# Altium project inverter.PrjPcb
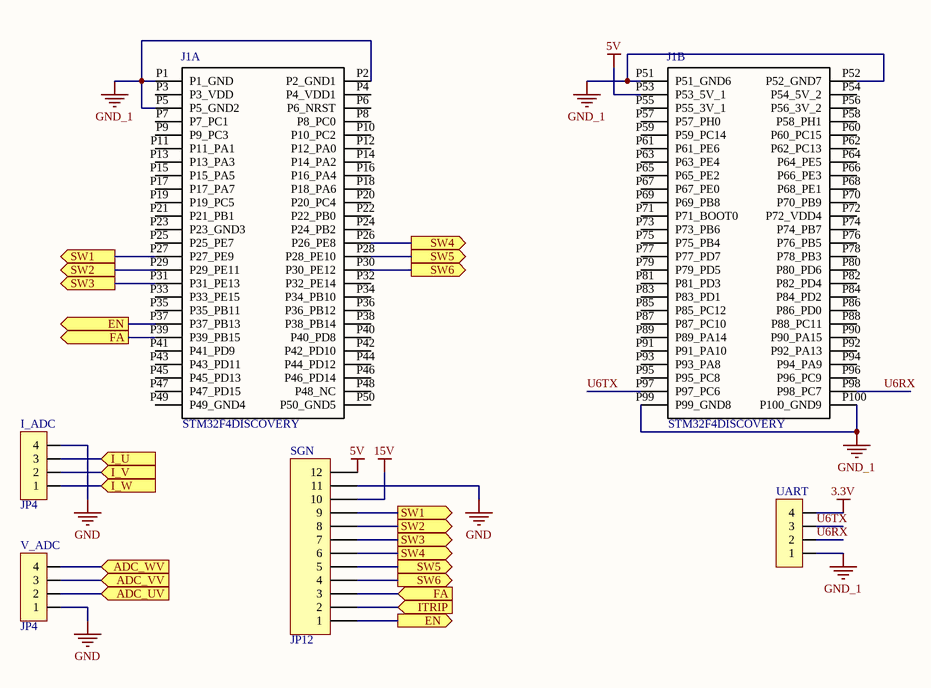
[diagram p0: KIT_STM32F4.SchDoc]
4 sheets, 124 parts. Net scope: flat (ports and power ports of the same name join across sheets).
Board file: PCB1.PcbDoc
Sheets:
  KIT_STM32F4.SchDoc
  Source.SchDoc
  Sheet1.SchDoc
  Sheet2.SchDoc

## Sheet KIT_STM32F4.SchDoc
size A

### Parts
I_ADC  JP4  [JP4-C1T]
J1  STM32F4DISCOVERY  [STMICROELECTRONICS_STM32F4DISCOVERY_STM32F4DISCOVERY(Primary)]  (parts A,B of 2)
SGN  JP12  [JP12-D1T]
UART  JP4  [JP4-C1T]  (value not drawn)
V_ADC  JP4  [JP4-C1T]

### Ports
ADC_UV (in), ADC_VV (in), ADC_WV (in), EN (out), FA (in), FA (out), I_U (in), I_V (in), I_W (in), ITRIP (in), SW1 (out), SW2 (out), SW3 (out), SW4 (out), SW5 (out), SW6 (out)

### Nets
3.3V: UART.4
5V: J1.P53(P53_5V_1) SGN.12
15V: SGN.10
GND: I_ADC.4 SGN.11 V_ADC.1
GND_1: J1.P1(P1_GND) J1.P2(P2_GND1) J1.P5(P5_GND2) J1.P51(P51_GND6) J1.P52(P52_GND7) J1.P99(P99_GND8) J1.P100(P100_GND9) UART.1
U6RX: J1.P98(P98_PC7) UART.2
U6TX: J1.P97(P97_PC6) UART.3
NetI_ADC_1: I_ADC.1 ; port I_W
NetI_ADC_2: I_ADC.2 ; port I_V
NetI_ADC_3: I_ADC.3 ; port I_U
NetIC1_2: J1.P27(P27_PE9) SGN.9 ; port SW1
NetIC1_3: J1.P29(P29_PE11) SGN.8 ; port SW2
NetIC1_4: J1.P31(P31_PE13) SGN.7 ; port SW3
NetIC1_5: J1.P26(P26_PE8) SGN.6 ; port SW4
NetIC1_6: J1.P28(P28_PE10) SGN.5 ; port SW5
NetIC1_7: J1.P30(P30_PE12) SGN.4 ; port SW6
NetIC1_8: J1.P39(P39_PB15) SGN.3 ; port FA
NetIC1_9: SGN.2 ; port ITRIP
NetIC1_10: J1.P37(P37_PB13) SGN.1 ; port EN
NetIC2_1: V_ADC.2 ; port ADC_UV
NetIC2_7: V_ADC.3 ; port ADC_VV
NetIC4_1: V_ADC.4 ; port ADC_WV

Not connected (* = marked no-connect by the designer): J1 P3(P3_VDD) P4(P4_VDD1) P6(P6_NRST) P7(P7_PC1) P8(P8_PC0) P9(P9_PC3) P10(P10_PC2) P11(P11_PA1) P12(P12_PA0) P13(P13_PA3) P14(P14_PA2) P15(P15_PA5) P16(P16_PA4) P17(P17_PA7) P18(P18_PA6) P19(P19_PC5) P20(P20_PC4) P21(P21_PB1) P22(P22_PB0) P23(P23_GND3) P24(P24_PB2) P25(P25_PE7) P32(P32_PE14) P33(P33_PE15) P34(P34_PB10) P35(P35_PB11) P36(P36_PB12) P38(P38_PB14) P40(P40_PD8) P41(P41_PD9) P42(P42_PD10) P43(P43_PD11) P44(P44_PD12) P45(P45_PD13) P46(P46_PD14) P47(P47_PD15) P48(P48_NC) P49(P49_GND4) P50(P50_GND5) P54(P54_5V_2) P55(P55_3V_1) P56(P56_3V_2) P57(P57_PH0) P58(P58_PH1) P59(P59_PC14) P60(P60_PC15) P61(P61_PE6) P62(P62_PC13) P63(P63_PE4) P64(P64_PE5) P65(P65_PE2) P66(P66_PE3) P67(P67_PE0) P68(P68_PE1) P69(P69_PB8) P70(P70_PB9) P71(P71_BOOT0) P72(P72_VDD4) P73(P73_PB6) P74(P74_PB7) P75(P75_PB4) P76(P76_PB5) P77(P77_PD7) P78(P78_PB3) P79(P79_PD5) P80(P80_PD6) P81(P81_PD3) P82(P82_PD4) P83(P83_PD1) P84(P84_PD2) P85(P85_PC12) P86(P86_PD0) P87(P87_PC10) P88(P88_PC11) P89(P89_PA14) P90(P90_PA15) P91(P91_PA10) P92(P92_PA13) P93(P93_PA8) P94(P94_PA9) P95(P95_PC8) P96(P96_PC9)

### Library data of the parts
I_ADC UART V_ADC = JP4: WR-PHD 2.54 mm Angled Socket Header; Manufacturer: W¨¹rth Elektronik eiSos GmbH; partNo: 613004143121; ComponentLink1 Description: Manufacturer; ComponentLink2 Description: Datasheet; NoPins: 04; Created Date: 29 March 2013; ComponentLink1URL: http://www.we-online.com; ComponentLink2URL: http://katalog.we-online.de/em/datasheet/6130xx143121.pdf; Created by: Karrer Zheng
J1 = STM32F4DISCOVERY: Development kit: ARM ST; pin strips, pin header; No.of; MF: STMicroelectronics; Package: None; MP: STM32F4DISCOVERY; Price: None; Availability: Unavailable; SnapEDA_Link: https://www.snapeda.com/parts/STM32F4DISCOVERY/STMicroelectronics/view-part/?ref=snap; Value: *
SGN = JP12: WR-PHD 2.54 mm Angled Socket Header; Manufacturer: W¨¹rth Elektronik eiSos GmbH; partNo: 613012143121; ComponentLink1 Description: Manufacturer; ComponentLink2 Description: Datasheet; NoPins: 12; Created Date: 29 March 2013; ComponentLink1URL: http://www.we-online.com; ComponentLink2URL: http://katalog.we-online.de/em/datasheet/6130xx143121.pdf; Created by: Karrer Zheng

## Sheet Source.SchDoc
size A3
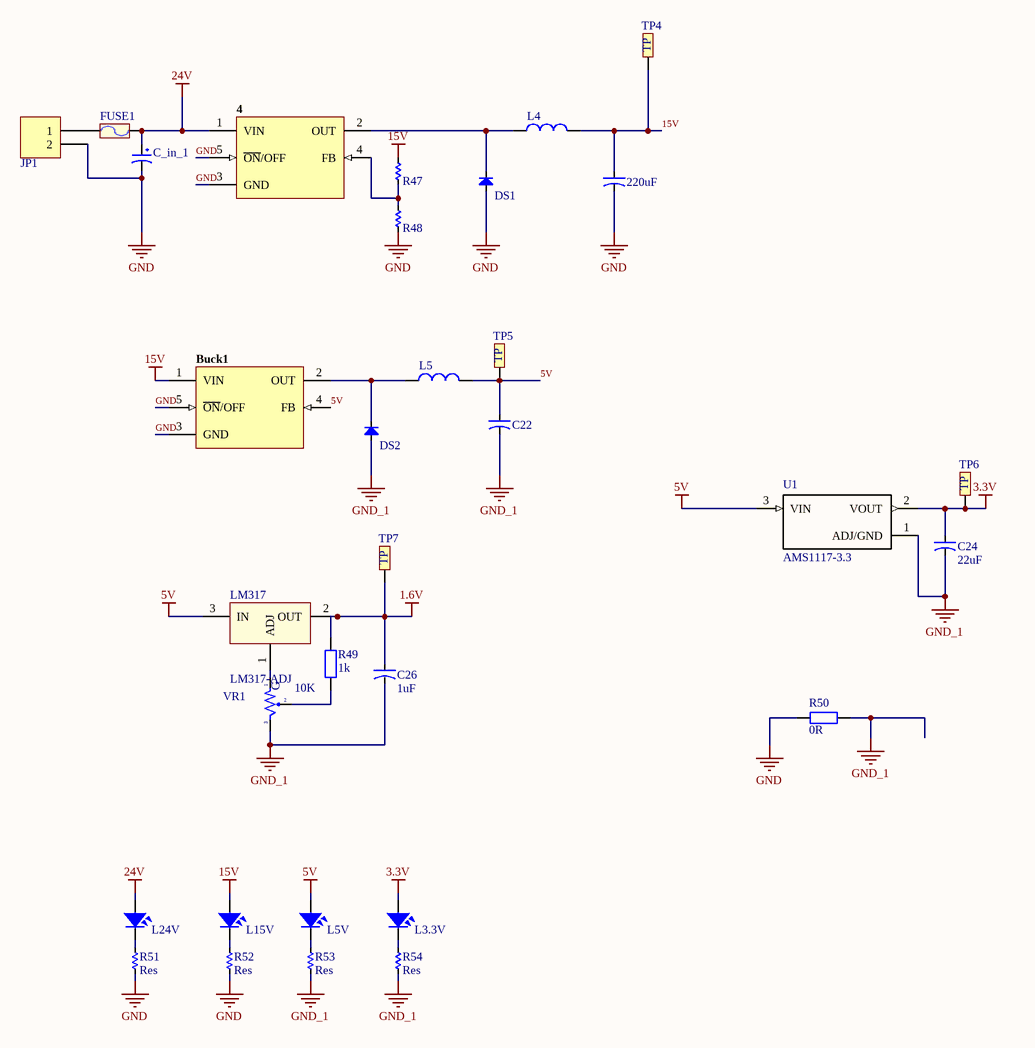
[diagram p1: Source.SchDoc]

### Parts
4  LM2576-ADJ  [TO263]  (value not drawn)
220uF  CN-ALU-DIP  [CA-ALU-5R]  (value not drawn)
Buck1  LM2576-5V  [TO263]  (value not drawn)
C22  >400uF  [CA-ALU-5R]  (value not drawn)
C24  22uF  [CA-ALU-2.54]
C26  1uF  [CA-ALU-2.54]
C_in_1  100->220uF  [CP1.5/3.4]  (value not drawn)
DS1  Diode  [DIO-1A]  (value not drawn)
DS2  Diode  [DIO-1A]  (value not drawn)
FUSE1  F1A  [Fuse1]  (value not drawn)
JP1  Header 2_1  [HED2]  (value not drawn)
L3.3V  LED  [LED-5-BLUE]  (value not drawn)
L4  100uH  [L01]  (value not drawn)
L5  (no value)  [L01]
L5V  LED  [LED-5-BLUE]  (value not drawn)
L15V  LED  [LED-5-BLUE]  (value not drawn)
L24V  LED  [LED-5-BLUE]  (value not drawn)
LM317  LM317-ADJ  [TO220H3]
R47  20-24  [RES-1/2W]  (value not drawn)
R48  2  [RES-1/2W]  (value not drawn)
R49  1k  [R1/4W]
R50  0R  [R1/4W]
R51  Res  [RES-1/2W]
R52  Res  [RES-1/2W]
R53  Res  [RES-1/2W]
R54  Res  [RES-1/2W]
TP4  (no value)  [TP]
TP5  (no value)  [TP]
TP6  (no value)  [TP]
TP7  (no value)  [TP]
U1  AMS1117-3.3  [*SOT229P700X180-4N]
VR1  10K  [VR-S2]

### Nets
1.6V: C26.1 LM317.2(OUT) R49.2 TP7.TP1
3.3V: C24.1 L3.3V.1 TP6.TP1 U1.2(VOUT)
5V: Buck1.4(FB) C22.1 L5.2 L5V.1 LM317.3(IN) TP5.TP1 U1.3(VIN)
15V: 220uF.1 Buck1.1(VIN) L4.2 L15V.1 R47.1 TP4.TP1
24V: 4.1(VIN) C_in_1.1 FUSE1.2 L24V.1
GND: 4.3(GND) 4.5(~{ON}/OFF) 220uF.2 Buck1.3(GND) Buck1.5(~{ON}/OFF) C_in_1.2 DS1.1(A) JP1.2 R48.2 R50.2 R51.2 R52.2
GND_1: C22.2 C24.2 C26.2 DS2.1(A) R50.1 R53.2 R54.2 U1.1(ADJ/GND) VR1.3
Net4_2: 4.2(OUT) DS1.2(K) L4.1
Net4_4: 4.4(FB) R47.2 R48.1
NetBuck1_2: Buck1.2(OUT) DS2.2(K) L5.1
NetFUSE1_1: FUSE1.1 JP1.1
NetL3.3V_2: L3.3V.2 R54.1
NetL5V_2: L5V.2 R53.1
NetL15V_2: L15V.2 R52.1
NetL24V_2: L24V.2 R51.1
NetLM317_1: LM317.1(ADJ) VR1.1
NetR49_1: R49.1 VR1.2

### Notes on the sheet
- (in symbol VR-S) G

### Library data of the parts
4 Buck1 = LM2576: Max Input Voltage: 12 V; Max Output Current: 3 (6.0 peak) A; Max Output Voltage: mV; Category: IC-Power; Min Input Voltage: mV; Min Output Voltage: mV; Mounting Technology: Surface Mount; Status: Unreleased; Supply Voltage: mV; Temperature Range: -40 to +125 degC
220uF C22 C24 C26 = CN-ALU-DIP: Capacitor (Semiconductor SIM Model); Value: 104; LatestRevisionDate: 17-Jul-2002; LatestRevisionNote: Re-released for DXP Platform.; PackageReference: C1206; Publisher: Altium Limited
C_in_1 = CP4: Cap 1000uF/16V - 220uF/50V; Description 5: 4,7uF>10uF/250V_3,3uF>10uF/400V - 2,2uF>4,7uF/450V; Description 1: 2200uF-3300uF/6,3V - 1000uF-2200uF/10V; Description 2: 1000uF/16V - 470uF => 1000uF/25V - 100uF/100V; Description 3: 330uF>470uF/35V_220uF>470uF/50V_10uF>22uF/250V; Description 4: 220uF => 330uF/63V - 10uF =>33uF/160 - 200V; Value: 1000uF/16V
DS1 DS2 = Diode: Default Diode; Code - JEDEC: DO-214-AB; Value: 1N5007; Published: 8-Jun-2000; Revision: July-2002: Re-released for DXP Platform.; Publisher: Altium Limited
FUSE1 = Fuse: Designed by: VanDungEvn; Value: Fuse
JP1 = Header 2_1: Header, 2-Pin; Manufacturer: Generic Components; Class: Connector; Value: Header 2
L3.3V L5V L15V L24V = LED: LED Single colour Green and Red; Value: LED 3 ly Single Colour
L4 L5 = L1: Inductor; Value: 150 mH
LM317 = LM317: Adj Voltage +1.2 -> +37V; Value: LM317
R47 R48 R51-R54 = Res: Manufacturer: Generic Components; Class: Passive; SubClass: R; Published: 08/06/2000; Publisher: Altium Hobart Technology Centre
R49 R50 = R1/4W: Resistor 1/4W; Value: R1/4W - 1K
TP4-TP7 = TP: CONNECT 1
U1 = AMS1117-3.3: Sot223/Pkg 1-Amp 3.3-Volt Low Drop Out Voltage Regulatator; MF: Advanced Monolithic Systems; Availability: Unavailable; SnapEDA_Link: https://www.snapeda.com/parts/AMS1117-3.3/Advanced%20Monolithic%20Systems/view-part/53450/?ref=snap; Price: None; Package: None; MP: AMS1117-3.3; Value: *
VR1 = VR-S: Var Resistor; Value: Volume 50k

## Sheet Sheet1.SchDoc
size A
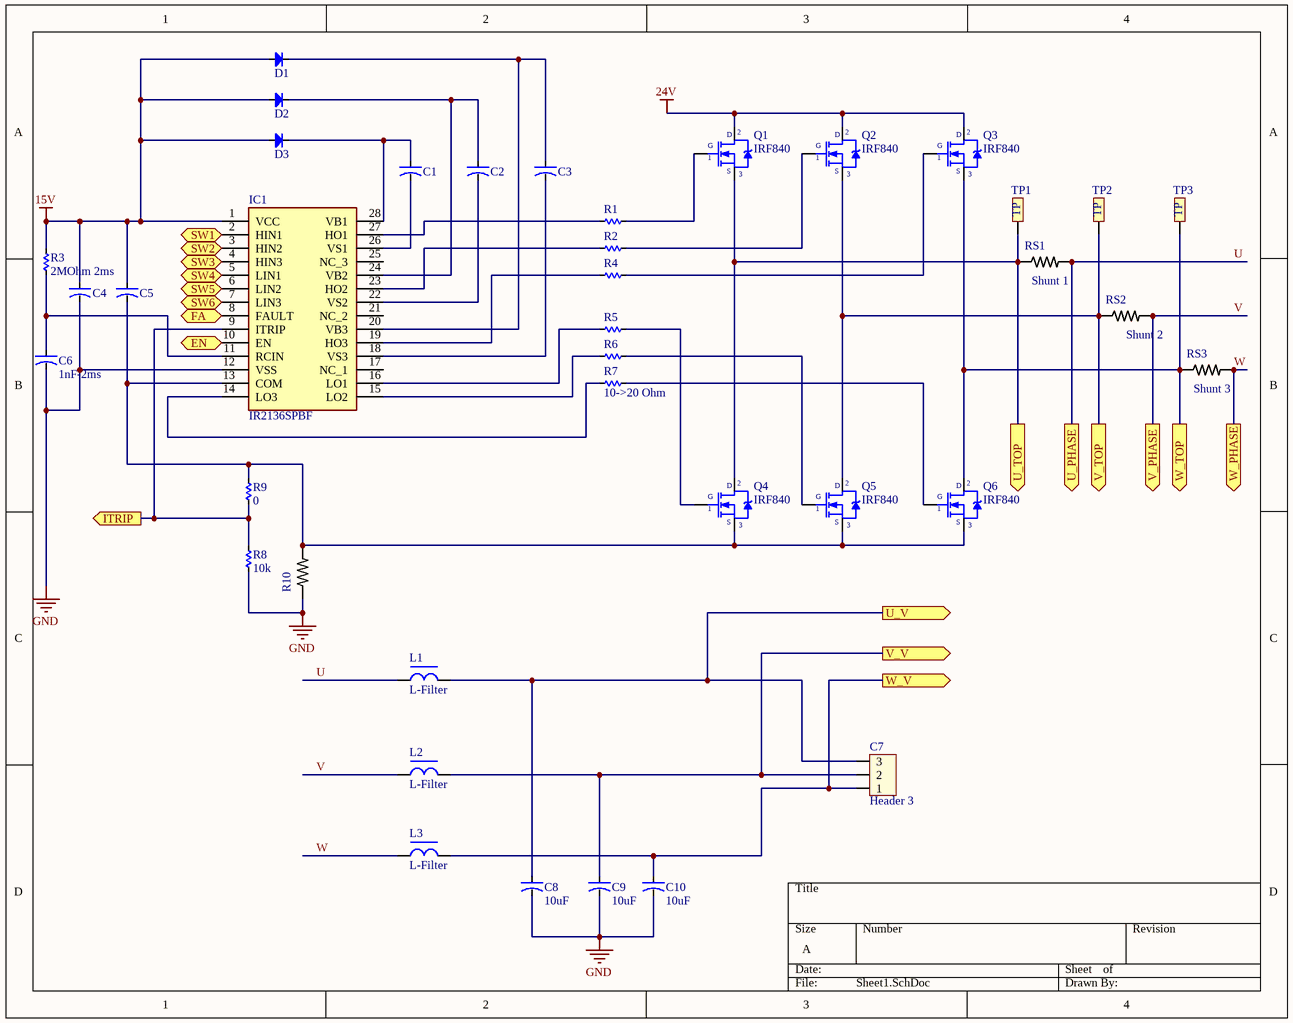
[diagram p2: Sheet1.SchDoc]

### Parts
C1  50-100uF  [CA-ALU-5R]  (value not drawn)
C2  50-100uF  [CA-ALU-5R]  (value not drawn)
C3  50-100uF  [CA-ALU-5R]  (value not drawn)
C4  to  [CA-ALU-5R]  (value not drawn)
C5  to  [CA-ALU-5R]  (value not drawn)
C6  1nF-2ms  [CA-ALU-2.54]
C7  Header 3  [HED3]
C8  10uF  [CA-ALU-5R]
C9  10uF  [CA-ALU-5R]
C10  10uF  [CA-ALU-5R]
D1  Diode  [DIO-1A]  (value not drawn)
D2  Diode  [DIO-1A]  (value not drawn)
D3  Diode  [DIO-1A]  (value not drawn)
IC1  IR2136SPBF  [SOIC127P1032X265-28N]
L1  L-Filter  [L-DIP-M-5.3]
L2  L-Filter  [L-DIP-M-5.3]
L3  L-Filter  [L-DIP-M-5.3]
Q1  IRF840  [TO220-123]
Q2  IRF840  [TO220-123]
Q3  IRF840  [TO220-123]
Q4  IRF840  [TO220-123]
Q5  IRF840  [TO220-123]
Q6  IRF840  [TO220-123]
R1  10->20 Ohm  [RES-1/2W]  (value not drawn)
R2  1K10->20 Ohm  [RES-1/2W]  (value not drawn)
R3  2MOhm 2ms  [RES-1/2W]
R4  10->20 Ohm  [RES-1/2W]  (value not drawn)
R5  10->20 Ohm  [RES-1/2W]  (value not drawn)
R6  10->20 Ohm  [RES-1/2W]  (value not drawn)
R7  10->20 Ohm  [RES-1/2W]
R8  10k  [RES-1/2W]
R9  0  [RES-1/2W]
R10  1-1625873-0  [*RESAD640W45L370D200]  (value not drawn)
RS1  1-1625873-0  [*RESAD640W45L370D200]  (value not drawn)
RS2  1-1625873-0  [*RESAD640W45L370D200]  (value not drawn)
RS3  1-1625873-0  [*RESAD640W45L370D200]  (value not drawn)
TP1  (no value)  [TP]
TP2  (no value)  [TP]
TP3  (no value)  [TP]

### Ports
EN (in), FA (out), ITRIP (out), SW1 (in), SW2 (in), SW3 (in), SW4 (in), SW5 (in), SW6 (in), U_PHASE (out), U_TOP (out), U_V (out), V_PHASE (out), V_TOP (out), V_V (out), W_PHASE (out), W_TOP (out), W_V (out)

### Nets
15V: C4.1 C5.1 D1.1(A) D2.1(A) D3.1(A) IC1.1(VCC) R3.1
24V: Q1.2(D) Q2.2(D) Q3.2(D)
GND: C4.2 C6.2 C8.2 C9.2 C10.2 IC1.12(VSS) R8.2 R10.1
U: L1.1 RS1.2 ; port U_PHASE
V: L2.1 RS2.2 ; port V_PHASE
W: L3.1 RS3.2 ; port W_PHASE
NetC1_1: C1.1 D3.2(K) IC1.28(VB1)
NetC1_2: C1.2 IC1.26(VS1)
NetC2_1: C2.1 D2.2(K) IC1.24(VB2)
NetC2_2: C2.2 IC1.22(VS2)
NetC3_1: C3.1 D1.2(K) IC1.20(VB3)
NetC3_2: C3.2 IC1.18(VS3)
NetC5_2: C5.2 IC1.13(COM) Q4.3(S) Q5.3(S) Q6.3(S) R9.1 R10.2
NetC6_1: C6.1 IC1.11(RCIN) R3.2
NetC7_1: C7.1 C10.1 L3.2 ; port W_V
NetC7_2: C7.2 C9.1 L2.2 ; port V_V
NetC7_3: C7.3 C8.1 L1.2 ; port U_V
NetIC1_2: IC1.2(HIN1) ; port SW1
NetIC1_3: IC1.3(HIN2) ; port SW2
NetIC1_4: IC1.4(HIN3) ; port SW3
NetIC1_5: IC1.5(LIN1) ; port SW4
NetIC1_6: IC1.6(LIN2) ; port SW5
NetIC1_7: IC1.7(LIN3) ; port SW6
NetIC1_8: IC1.8(FAULT) ; port FA
NetIC1_9: IC1.9(ITRIP) R8.1 R9.2 ; port ITRIP
NetIC1_10: IC1.10(EN) ; port EN
NetIC1_14: IC1.14(LO3) R7.2
NetIC1_15: IC1.15(LO2) R6.2
NetIC1_16: IC1.16(LO1) R5.2
NetIC1_19: IC1.19(HO3) R4.2
NetIC1_23: IC1.23(HO2) R2.2
NetIC1_27: IC1.27(HO1) R1.2
NetQ1_1: Q1.1(G) R1.1
NetQ1_3: Q1.3(S) Q4.2(D) RS1.1 TP1.TP1 ; port U_TOP
NetQ2_1: Q2.1(G) R2.1
NetQ2_3: Q2.3(S) Q5.2(D) RS2.1 TP2.TP1 ; port V_TOP
NetQ3_1: Q3.1(G) R4.1
NetQ3_3: Q3.3(S) Q6.2(D) RS3.1 TP3.TP1 ; port W_TOP
NetQ4_1: Q4.1(G) R5.1
NetQ5_1: Q5.1(G) R6.1
NetQ6_1: Q6.1(G) R7.1

Not connected (* = marked no-connect by the designer): IC1 17(NC_1) 21(NC_2) 25(NC_3)

### Notes on the sheet
- (near RS1) Shunt 1
- (near RS2) Shunt 2
- (near RS3) Shunt 3

### Library data of the parts
C1-C6 C8-C10 = CN-ALU-DIP: as 220uF on sheet Source; LatestRevisionDate: 17-Jul-2002; LatestRevisionNote: Re-released for DXP Platform.; PackageReference: C1206; Publisher: Altium Limited
C7 = Hed3: Header 3 (Green); Value: Header 3
D1-D3 = Diode: as DS1 on sheet Source; Published: 8-Jun-2000; Revision: July-2002: Re-released for DXP Platform.; Publisher: Altium Limited
IC1 = IR2136SPBF: Integrated Circuit; Manufacturer_Name: Infineon; Allied_Number: 70017147; Datasheet Link: https://www.infineon.com/dgdl/ir2136.pdf?fileId=5546d462533600a4015355c8a02116a5; Height: 2.65mm; Manufacturer_Part_Number: IR2136SPBF; Mouser Part Number: 942-IR2136SPBF; Mouser Price/Stock: https://www.mouser.co.uk/ProductDetail/Infineon-IR/IR2136SPBF?qs=ellYJlE8XiFRzygBXfcgZw%3D%3D; RS Part Number: 5412284P; RS Price/Stock: http://uk.rs-online.com/web/p/products/5412284P; Allied Price/Stock: https://www.alliedelec.com/infineon-ir2136spbf/70017147/
L1-L3 = L-DIP-1: Inductor; Value: 150 mH
Q1-Q6 = IRF840: MOSFET N - CHANNEL 500V - 0.75 - 8A - TO-220; Value: IRF840
R1-R9 = Res: as R47 on sheet Source; Published: 08/06/2000; Publisher: Altium Hobart Technology Centre
R10 RS1-RS3 = RES_KIT_LR0204R: RS LR0204 RESISTOR KIT; MF: TE Connectivity AMP Connectors; MP: RES KIT LR0204R; Availability: Unavailable; SnapEDA_Link: https://www.snapeda.com/parts/RES%20KIT%20LR0204R/TE%20Connectivity/view-part/3223324/?ref=snap; Price: None; TE_purchase_URL: https://www.te.com/usa-en/product-1-1625873-0.html?te_bu=Cor&te_type=disp&te_campaign=seda_glo_cor-seda-global-disp-prtnr-fy19-seda-model-bom-cta_sma-317_1&elqCampaignId=32493; Package: None; Value: *
TP1-TP3 = TP: CONNECT 1

## Sheet Sheet2.SchDoc
size A
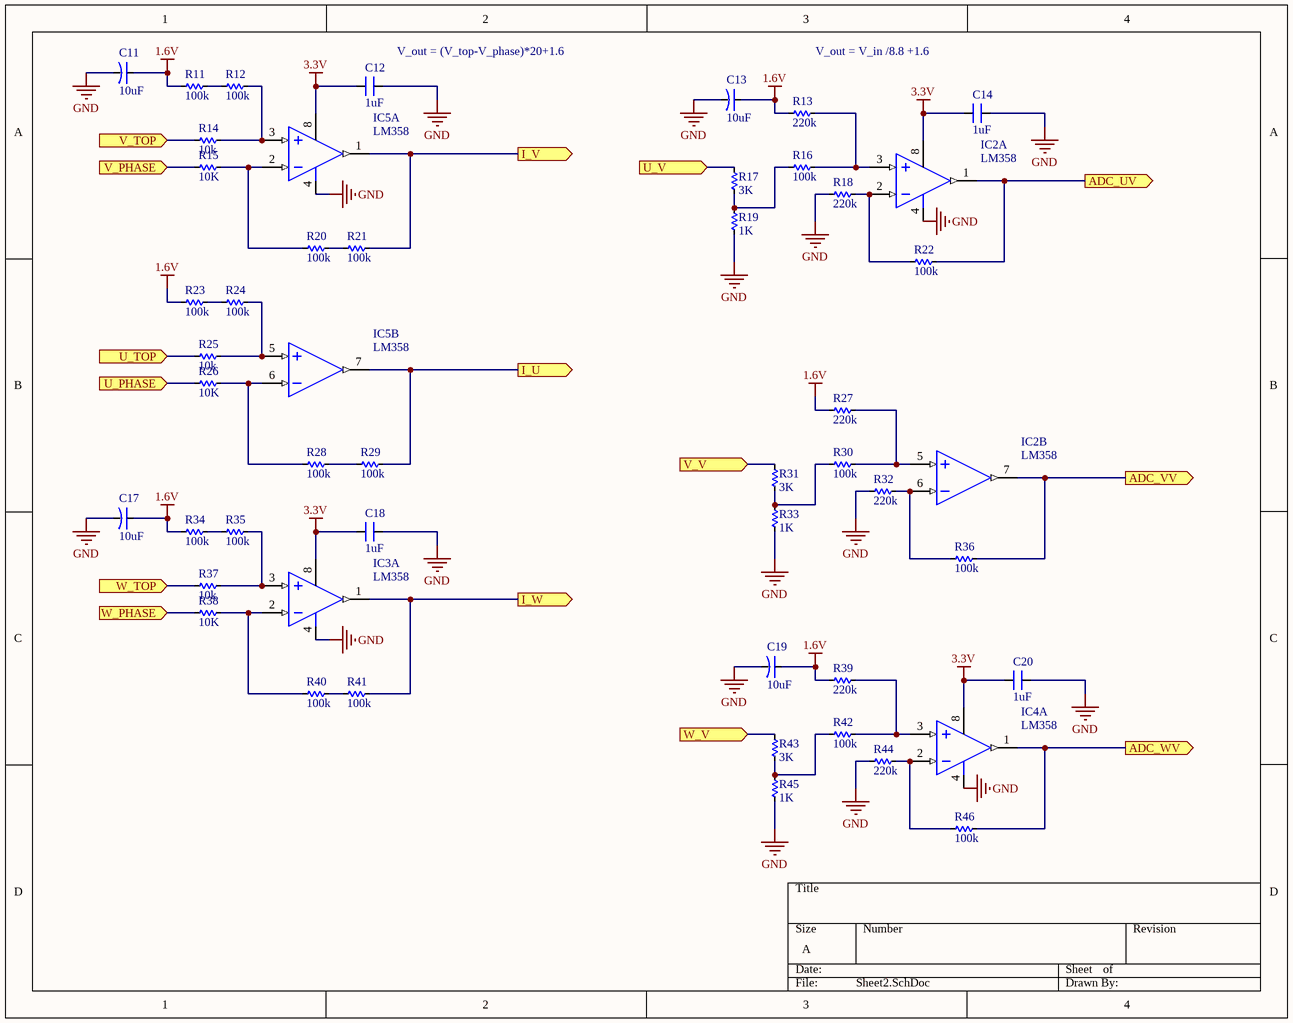
[diagram p3: Sheet2.SchDoc]

### Parts
C11  10uF  [CA-ALU-5R]
C12  1uF  [CN1]
C13  10uF  [CA-ALU-5R]
C14  1uF  [CN1]
C17  10uF  [CA-ALU-5R]
C18  1uF  [CN1]
C19  10uF  [CA-ALU-5R]
C20  1uF  [CN1]
IC2  LM358  [DIP8]  (parts A,B of 2)
IC3  LM358  [DIP8]  (part A of 2)
IC4  LM358  [DIP8]  (part A of 2)
IC5  LM358  [DIP8]  (parts A,B of 2)
R11  100k  [RES-1/2W]
R12  100k  [RES-1/2W]
R13  220k  [RES-1/2W]
R14  10k  [RES-1/2W]
R15  10K  [RES-1/2W]
R16  100k  [RES-1/2W]
R17  3K  [RES-1/2W]
R18  220k  [RES-1/2W]
R19  1K  [RES-1/2W]
R20  100k  [RES-1/2W]
R21  100k  [RES-1/2W]
R22  100k  [RES-1/2W]
R23  100k  [RES-1/2W]
R24  100k  [RES-1/2W]
R25  10k  [RES-1/2W]
R26  10K  [RES-1/2W]
R27  220k  [RES-1/2W]
R28  100k  [RES-1/2W]
R29  100k  [RES-1/2W]
R30  100k  [RES-1/2W]
R31  3K  [RES-1/2W]
R32  220k  [RES-1/2W]
R33  1K  [RES-1/2W]
R34  100k  [RES-1/2W]
R35  100k  [RES-1/2W]
R36  100k  [RES-1/2W]
R37  10k  [RES-1/2W]
R38  10K  [RES-1/2W]
R39  220k  [RES-1/2W]
R40  100k  [RES-1/2W]
R41  100k  [RES-1/2W]
R42  100k  [RES-1/2W]
R43  3K  [RES-1/2W]
R44  220k  [RES-1/2W]
R45  1K  [RES-1/2W]
R46  100k  [RES-1/2W]

### Ports
ADC_UV (out), ADC_VV (out), ADC_WV (out), I_U (out), I_V (out), I_W (out), U_PHASE (in), U_TOP (in), U_V (in), V_PHASE (in), V_TOP (in), V_V (in), W_PHASE (in), W_TOP (in), W_V (in)

### Nets
1.6V: C11.1 C13.1 C17.1 C19.1 R11.2 R13.2 R23.2 R27.2 R34.2 R39.2
3.3V: C12.1 C14.1 C18.1 C20.1 IC2.8(+V) IC3.8(+V) IC4.8(+V) IC5.8(+V)
GND: C11.2 C12.2 C13.2 C14.2 C17.2 C18.2 C19.2 C20.2 IC2.4(-V) IC3.4(-V) IC4.4(-V) IC5.4(-V) R18.2 R19.2 R32.2 R33.2 R44.2 R45.2
U: R26.2 ; port U_PHASE
V: R15.2 ; port V_PHASE
W: R38.2 ; port W_PHASE
NetC7_1: R43.1 ; port W_V
NetC7_2: R31.1 ; port V_V
NetC7_3: R17.1 ; port U_V
NetI_ADC_1: IC3.1(OUT) R41.1 ; port I_W
NetI_ADC_2: IC5.1(OUT) R21.1 ; port I_V
NetI_ADC_3: IC5.7(OUT) R29.1 ; port I_U
NetIC2_1: IC2.1(OUT) R22.1 ; port ADC_UV
NetIC2_2: IC2.2(IN-) R18.1 R22.2
NetIC2_3: IC2.3(IN+) R13.1 R16.1
NetIC2_5: IC2.5(IN+) R27.1 R30.1
NetIC2_6: IC2.6(IN-) R32.1 R36.2
NetIC2_7: IC2.7(OUT) R36.1 ; port ADC_VV
NetIC3_2: IC3.2(IN-) R38.1 R40.2
NetIC3_3: IC3.3(IN+) R35.1 R37.1
NetIC4_1: IC4.1(OUT) R46.1 ; port ADC_WV
NetIC4_2: IC4.2(IN-) R44.1 R46.2
NetIC4_3: IC4.3(IN+) R39.1 R42.1
NetIC5_2: IC5.2(IN-) R15.1 R20.2
NetIC5_3: IC5.3(IN+) R12.1 R14.1
NetIC5_5: IC5.5(IN+) R24.1 R25.1
NetIC5_6: IC5.6(IN-) R26.1 R28.2
NetQ1_3: R25.2 ; port U_TOP
NetQ2_3: R14.2 ; port V_TOP
NetQ3_3: R37.2 ; port W_TOP
NetR11_1: R11.1 R12.2
NetR16_2: R16.2 R17.2 R19.1
NetR20_1: R20.1 R21.2
NetR23_1: R23.1 R24.2
NetR28_1: R28.1 R29.2
NetR30_2: R30.2 R31.2 R33.1
NetR34_1: R34.1 R35.2
NetR40_1: R40.1 R41.2
NetR42_2: R42.2 R43.2 R45.1

### Notes on the sheet
- (near C12) V_out = (V_top-V_phase)*20+1.6
- V_out = V_in /8.8 +1.6

### Library data of the parts
C11 C13 C17 C19 = CN-ALU-DIP: as 220uF on sheet Source; LatestRevisionDate: 17-Jul-2002; LatestRevisionNote: Re-released for DXP Platform.; PackageReference: C1206; Publisher: Altium Limited
C12 C14 C18 C20 = CN1: Cap np  1pF - 472pF; Value: 100pF
IC2-IC5 = LM358: Low-Power Dual Operational Amplifier; Value: LM358
R11-R46 = Res: as R47 on sheet Source; Published: 08/06/2000; Publisher: Altium Hobart Technology Centre

## Nets that join several sheets
1.6V: Source (C26.1 LM317.2 R49.2 TP7.TP1), Sheet2 (10 pins)
3.3V: KIT_STM32F4 (UART.4), Source (C24.1 L3.3V.1 TP6.TP1 U1.2), Sheet2 (8 pins)
5V: KIT_STM32F4 (J1.P53 SGN.12), Source (7 pins)
15V: KIT_STM32F4 (SGN.10), Source (6 pins), Sheet1 (7 pins)
24V: Source (4.1 C_in_1.1 FUSE1.2 L24V.1), Sheet1 (Q1.2 Q2.2 Q3.2)
GND: KIT_STM32F4 (I_ADC.4 SGN.11 V_ADC.1), Source (12 pins), Sheet1 (8 pins), Sheet2 (18 pins)
GND_1: KIT_STM32F4 (8 pins), Source (9 pins)
NetC7_1: Sheet1 (C7.1 C10.1 L3.2), Sheet2 (R43.1)
NetC7_2: Sheet1 (C7.2 C9.1 L2.2), Sheet2 (R31.1)
NetC7_3: Sheet1 (C7.3 C8.1 L1.2), Sheet2 (R17.1)
NetI_ADC_1: KIT_STM32F4 (I_ADC.1), Sheet2 (IC3.1 R41.1)
NetI_ADC_2: KIT_STM32F4 (I_ADC.2), Sheet2 (IC5.1 R21.1)
NetI_ADC_3: KIT_STM32F4 (I_ADC.3), Sheet2 (IC5.7 R29.1)
NetIC1_2: KIT_STM32F4 (J1.P27 SGN.9), Sheet1 (IC1.2)
NetIC1_3: KIT_STM32F4 (J1.P29 SGN.8), Sheet1 (IC1.3)
NetIC1_4: KIT_STM32F4 (J1.P31 SGN.7), Sheet1 (IC1.4)
NetIC1_5: KIT_STM32F4 (J1.P26 SGN.6), Sheet1 (IC1.5)
NetIC1_6: KIT_STM32F4 (J1.P28 SGN.5), Sheet1 (IC1.6)
NetIC1_7: KIT_STM32F4 (J1.P30 SGN.4), Sheet1 (IC1.7)
NetIC1_8: KIT_STM32F4 (J1.P39 SGN.3), Sheet1 (IC1.8)
NetIC1_9: KIT_STM32F4 (SGN.2), Sheet1 (IC1.9 R8.1 R9.2)
NetIC1_10: KIT_STM32F4 (J1.P37 SGN.1), Sheet1 (IC1.10)
NetIC2_1: KIT_STM32F4 (V_ADC.2), Sheet2 (IC2.1 R22.1)
NetIC2_7: KIT_STM32F4 (V_ADC.3), Sheet2 (IC2.7 R36.1)
NetIC4_1: KIT_STM32F4 (V_ADC.4), Sheet2 (IC4.1 R46.1)
NetQ1_3: Sheet1 (Q1.3 Q4.2 RS1.1 TP1.TP1), Sheet2 (R25.2)
NetQ2_3: Sheet1 (Q2.3 Q5.2 RS2.1 TP2.TP1), Sheet2 (R14.2)
NetQ3_3: Sheet1 (Q3.3 Q6.2 RS3.1 TP3.TP1), Sheet2 (R37.2)
U: Sheet1 (L1.1 RS1.2), Sheet2 (R26.2)
V: Sheet1 (L2.1 RS2.2), Sheet2 (R15.2)
W: Sheet1 (L3.1 RS3.2), Sheet2 (R38.2)